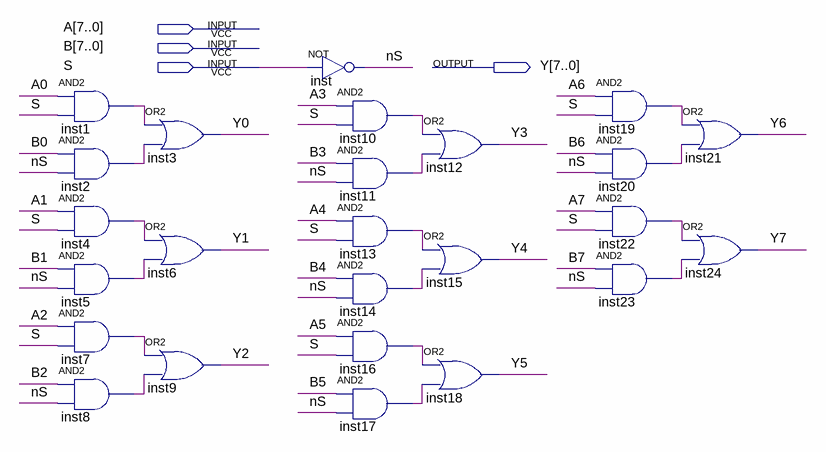
[diagram p0: schematic sheet]
// Quartus schematic multiplex.bdf as structural Verilog: 25 symbols, 4 pins
module multiplex (
  input  [7:0] A,
  input  [7:0] B,
  input  S,
  output [7:0] Y
);

  wire inst1_out, inst2_out, inst4_out, inst5_out, inst7_out, inst8_out, inst10_out, inst11_out, inst13_out,
       inst14_out, inst16_out, inst17_out, inst19_out, inst20_out, inst22_out, inst23_out, nS;

  and inst1 (inst1_out, A[0], S);
  and inst2 (inst2_out, B[0], nS);
  and inst4 (inst4_out, A[1], S);
  and inst5 (inst5_out, B[1], nS);
  and inst7 (inst7_out, A[2], S);
  and inst8 (inst8_out, B[2], nS);
  or inst3 (Y[0], inst1_out, inst2_out);
  or inst6 (Y[1], inst4_out, inst5_out);
  or inst9 (Y[2], inst7_out, inst8_out);
  not inst (nS, S);
  and inst10 (inst10_out, A[3], S);
  and inst11 (inst11_out, B[3], nS);
  and inst13 (inst13_out, A[4], S);
  and inst14 (inst14_out, B[4], nS);
  and inst16 (inst16_out, A[5], S);
  and inst17 (inst17_out, B[5], nS);
  or inst12 (Y[3], inst10_out, inst11_out);
  or inst15 (Y[4], inst13_out, inst14_out);
  or inst18 (Y[5], inst16_out, inst17_out);
  and inst19 (inst19_out, A[6], S);
  and inst20 (inst20_out, B[6], nS);
  and inst22 (inst22_out, A[7], S);
  and inst23 (inst23_out, B[7], nS);
  or inst21 (Y[6], inst19_out, inst20_out);
  or inst24 (Y[7], inst22_out, inst23_out);
endmodule
